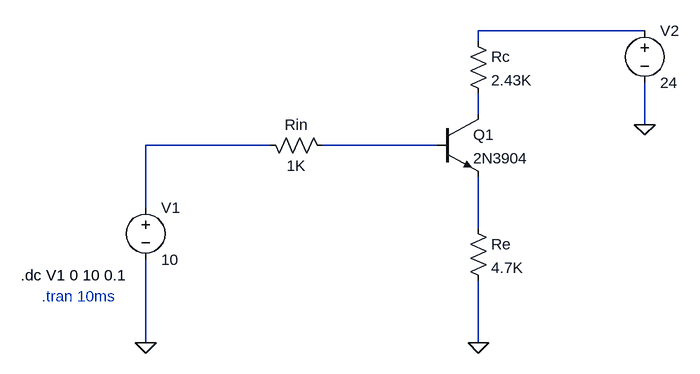
[diagram p0: schematic ip buffer.asc]
ip buffer.asc, the LTspice schematic file:
Version 4.1
SHEET 1 880 680
WIRE 432 -64 176 -64
WIRE 176 -48 176 -64
WIRE 176 64 176 32
WIRE 432 80 432 16
WIRE -144 112 -336 112
WIRE 112 112 -64 112
WIRE -336 208 -336 112
WIRE 176 240 176 160
WIRE -336 416 -336 288
WIRE 176 416 176 320
FLAG 176 416 0
FLAG -336 416 0
FLAG 432 80 0
SYMBOL npn 112 64 R0
SYMATTR InstName Q1
SYMATTR Value 2N3904
SYMBOL res 160 224 R0
SYMATTR InstName Re
SYMATTR Value 4.7K
SYMATTR SpiceLine tol=1 pwr=0.1
SYMBOL voltage 432 -80 R0
WINDOW 123 0 0 Left 0
WINDOW 39 0 0 Left 0
SYMATTR InstName V2
SYMATTR Value 24
SYMBOL voltage -336 192 R0
WINDOW 123 0 0 Left 0
WINDOW 39 0 0 Left 0
SYMATTR InstName V1
SYMATTR Value 10
SYMBOL res -48 128 M270
WINDOW 0 32 56 VTop 2
WINDOW 3 0 56 VBottom 2
SYMATTR InstName Rin
SYMATTR Value 1K
SYMATTR SpiceLine tol=1 pwr=0.1
SYMBOL res 160 -64 R0
SYMATTR InstName Rc
SYMATTR Value 2.43K
SYMATTR SpiceLine tol=1 pwr=0.1
TEXT -528 312 Left 2 !.dc V1 0 10 0.1
TEXT -496 344 Left 2 ;.tran 10ms

The netlist it stands for:
* ip buffer.asc
Q1 N002 N004 N005 0 2N3904
Re N005 0 4.7K tol=1 pwr=0.1
V2 N001 0 24
V1 N003 0 10
Rin N004 N003 1K tol=1 pwr=0.1
Rc N001 N002 2.43K tol=1 pwr=0.1
.model NPN NPN
.model PNP PNP
.lib standard.bjt
.dc V1 0 10 0.1
* .tran 10ms
.backanno
.end